# Altium schematic sheet target_connectors.SchDoc
size A4; SheetNumber: 3
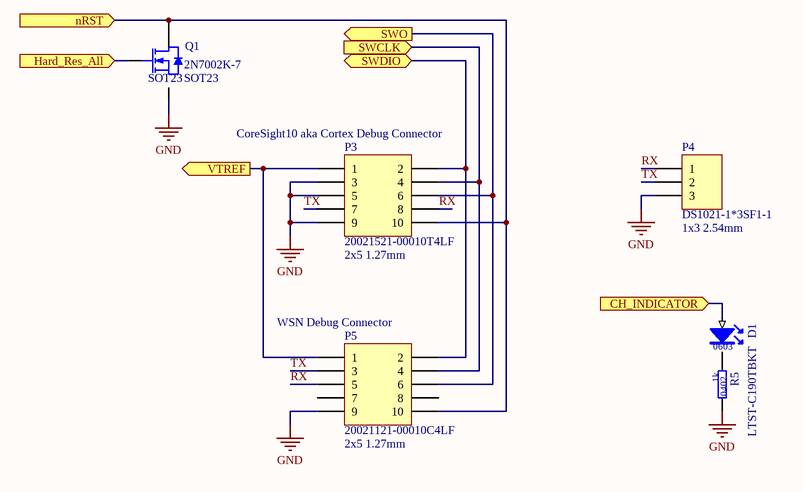
[diagram p0: target_connectors.SchDoc]

## Parts
D1  value LTST-C190TBKT  SCH_Footprint: 0603  [OL_0603_1608]  (hidden comment: Blue Led)
P3  value 20021521-00010T4LF  SCH_Footprint: 2x5 1.27mm  [P_IDC_2x5_1.27]  (hidden comment: IDC 1.27 2x5)
P4  value DS1021-1*3SF1-1  SCH_Footprint: 1x3 2.54mm  [P_HEADER_1x3_2.54]  (hidden comment: Goldpin)
P5  value 20021121-00010C4LF  SCH_Footprint: 2x5 1.27mm  [P_HEADER_2x5_1.27]  (hidden comment: Jtag)
Q1  SCH_Footprint: SOT23  [SOT23_TO236_SC59]  (hidden comment: 2N7002K-7)
R5  value 1k  SCH_Footprint: 0402  [R_0402_1005]  (hidden comment: Resistor)

## Ports
CH_INDICATOR (in), Hard_Res_All (in), nRST (in), SWCLK (in), SWDIO (bidir), SWO (out), VTREF (out)

## Nets
GND: P3.3 P3.5 P3.9 P4.3 P5.9 Q1.2(S) R5.2
CH_INDICATOR: D1.2(A) ; port CH_INDICATOR
Hard_Res_All: Q1.1(G) ; port Hard_Res_All
nRST: P3.10 P5.10 Q1.3(D) ; port nRST
RX: P3.8 P4.1 P5.5
SWCLK: P3.4 P5.4 ; port SWCLK
SWDIO: P3.2 P5.2 ; port SWDIO
SWO: P3.6 P5.6 ; port SWO
TX: P3.7 P4.2 P5.3
VTREF: P3.1 P5.1 ; port VTREF
NetD1_1: D1.1(K) R5.1

Not connected (* = marked no-connect by the designer): P5 7 8

## Notes on the sheet
- (near P3) CoreSight10 aka Cortex Debug Connector
- (near P5) WSN Debug Connector

## Library data of the parts
D1 = OL_B_0603: LED_BLUE; Manufacturer: Lite-On; Part Number: OL_B_0603; HelpURL: https://datasheet.octopart.com/LTST-C190TBKT-Lite-On-datasheet-158557.pdf; Manufacturer Part Number: LTST-C190TBKT; Supplier 1: TME; Supplier Part Number 1: LTST-C190TBKT; Supplier 2: RS Components; Supplier Part Number 2: 6920994P; Supplier 3: Farnell; Supplier 4: Mouser; Supplier Part Number 4: 859-LTST-C190TBKT; Supplier 5: Digi-Key; Supplier Part Number 5: 160-1646-1-ND
P3 = P_IDC_2x5_1.27: Header, 10-Pin, Dual row; Manufacturer: Amphenol; Part Number: P_IDC_2x5_1.27; Component Type: Standard; HelpURL: https://cdn.amphenol-icc.com/media/wysiwyg/files/drawing/20021521.pdf; Manufacturer Part Number: 20021521-00010T4LF; Supplier 1: TME; Supplier 2: RS Components; Supplier 3: Farnell; Supplier 4: Mouser; Supplier Part Number 4: 649-221521-00010T4LF; Supplier 5: Digi-Key; Supplier Part Number 5: 609-6534-ND
P4 = P_HEADER_1x3_2.54: Header, 3-Pin; Manufacturer: Connfly; Part Number: P_HEADER_1x3_2.54; Component Type: Standard; HelpURL: http://www.tme.eu/en/Document/cc301e58a5da78cb543a94b5a5b7f06a/DS1021.pdf; Manufacturer Part Number: DS1021-1*3SF1-1; Supplier 1: TME; Supplier Part Number 1: ZL201-03G; Supplier 2: RS Components; Supplier 3: Farnell; Supplier 4: Mouser; Supplier 5: Digi-Key
P5 = P_HEADER_2x5_1.27: Header, 10-Pin, Dual row; Manufacturer: FCI; Part Number: P_HEADER_2x5_1.27; Component Type: Standard; HelpURL: http://www.mouser.com/catalog/645/usd/1591.pdf; Manufacturer Part Number: 20021121-00010C4LF; Supplier 1: TME; Supplier Part Number 1: 20021121-00010C4LF; Supplier 2: RS Components; Supplier Part Number 2: 794-4584; Supplier 3: Farnell; Supplier Part Number 3: 1865279; Supplier 4: Mouser; Supplier Part Number 4: 649-202112100010C4LF; Supplier 5: Digi-Key; Supplier Part Number 5: 609-3695-1-ND
Q1 = QN_2N7002K-7_60V_350mA: Manufacturer: DIODES inc; Type: N-MOS; Voltage: 60V; Current: 0A8; Part Number: QN_2N7002K-7_60V_350mA; Value: 2N7002K-7; HelpURL: http://datasheet.octopart.com/2N7002K-7-Diodes-Inc.-datasheet-12515815.pdf; Manufacturer Part Number: 2N7002K-7; Supplier 1: TME; Supplier 2: RS Components; Supplier Part Number 2: 7703383; Supplier 3: Farnell; Supplier Part Number 3: 1713825; Supplier 4: Mouser; Supplier Part Number 4: 621-2N7002K-7; Supplier 5: Digi-Key; Supplier Part Number 5: 2N7002K-7DICT-ND
R5 = R_1k_0402_1: Manufacturer: Yageo; Manufacturer Part Number: RC0402FR-071K; Voltage: 50V; Power: 63mW; Tolerance: 1%; Part Number: R_1k_0402_1; HelpURL: http://www.tme.eu/pl/Document/1a2bc76e2be68b3b1670068306778ce6/rc0402yageo.pdf; Supplier 1: TME; Supplier Part Number 1: RC0402FR-071K; Supplier 2: RS Components; Supplier 3: Farnell; Supplier Part Number 3: 9239235; Supplier 4: Mouser; Supplier Part Number 4: 603-RC0402FR-071KP; Supplier 5: Digi-Key; Supplier Part Number 5: 311-1.00KLRCT-ND